# Altium schematic sheet ATmega16_RTD.SchDoc
size 594 x 420 mm
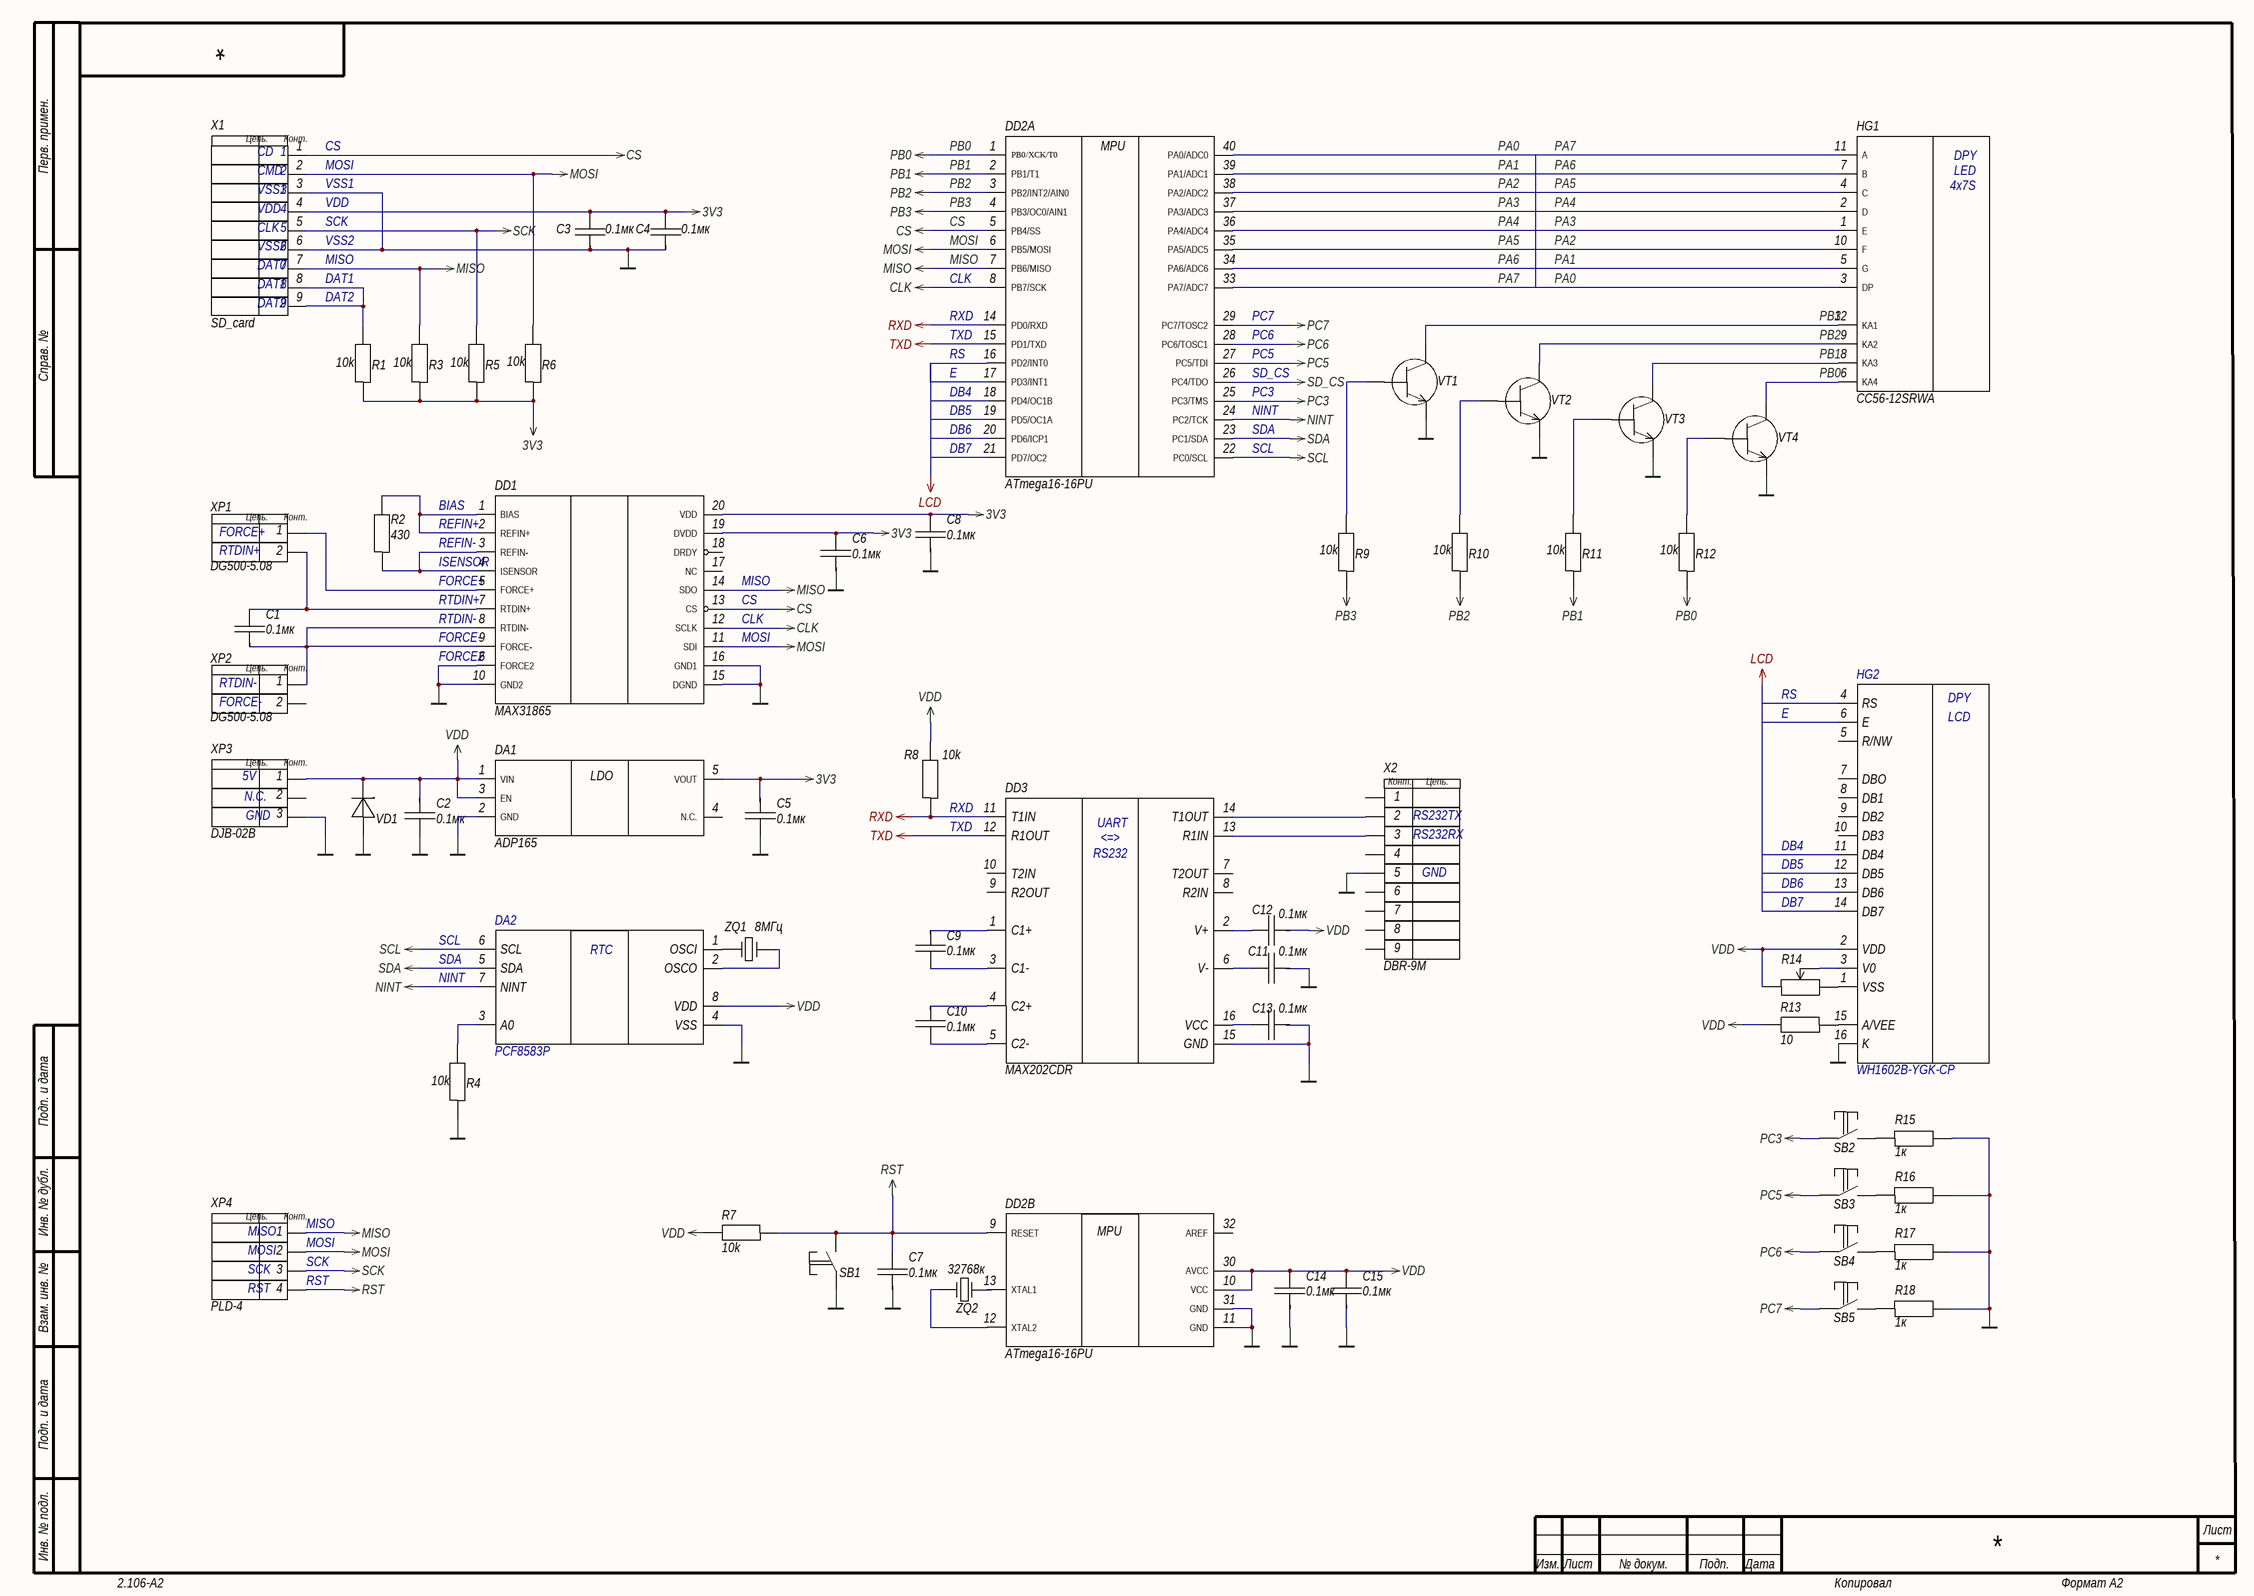
[diagram p0: ATmega16_RTD.SchDoc]

## Parts
C1  0.1мк  [Capacitor]
C2  0.1мк  [Capacitor]
C3  0.1мк  [Capacitor]
C4  0.1мк  [Capacitor]
C5  0.1мк  [Capacitor]
C6  0.1мк  [Capacitor]
C7  0.1мк  [Capacitor]
C8  0.1мк  [Capacitor]
C9  0.1мк  [Capacitor]
C10  0.1мк  [Capacitor]
C11  0.1мк  [Capacitor]
C12  0.1мк  [Capacitor]
C13  0.1мк  [Capacitor]
C14  0.1мк  [Capacitor]
C15  0.1мк  [Capacitor]
DA1  ADP165
DA2  PCF8583P
DD1  MAX31865
DD2  ATmega16-16PU  (parts A,B of 2)
DD3  MAX202CDR
HG1  CC56-12SRWA
HG2  WH1602B-YGK-CP
R1  10k  [0603_RES]
R2  430  [0603_RES]
R3  10k  [0603_RES]
R4  10k  [0603_RES]
R5  10k  [0603_RES]
R6  10k  [0603_RES]
R7  10k  [0603_RES]
R8  10k  [0603_RES]
R9  10k  [0603_RES]
R10  10k  [0603_RES]
R11  10k  [0603_RES]
R12  10k  [0603_RES]
R13  10  [0603_RES]
R14  (no value)  [0603_RES]
R15  1к  [0603_RES]
R16  1к  [0603_RES]
R17  1к  [0603_RES]
R18  1к  [0603_RES]
SB1  2-1437565-7  [TACT_Switch]  (value not drawn)
SB2  2-1437565-7  [TACT_Switch]  (value not drawn)
SB3  2-1437565-7  [TACT_Switch]  (value not drawn)
SB4  2-1437565-7  [TACT_Switch]  (value not drawn)
SB5  2-1437565-7  [TACT_Switch]  (value not drawn)
VD1  SS14-E3/61T  [SS14-E3/61T]  (value not drawn)
VT1  transistor_BC546_sevseg  (value not drawn)
VT2  transistor_BC546_sevseg  (value not drawn)
VT3  transistor_BC546_sevseg  (value not drawn)
VT4  transistor_BC546_sevseg  (value not drawn)
X1  SD_card
X2  DBR-9M
XP1  DG500-5.08
XP2  DG500-5.08
XP3  DJB-02B
XP4  PLD-4
ZQ1  8МГц  [KX-KT 16.0 MHz]
ZQ2  32768к  [KX-KT 16.0 MHz]

## Nets
3V3: C3.1 C4.1 C5.2 C6.1 C8.1 DA1.5(VOUT) DD1.19(DVDD) DD1.20(VDD) R1.1(GND) R3.1(GND) R5.1(GND) R6.1(GND) X1.4(VDD)
CLK: DD1.12(SCLK) DD2.8(PB7/SCK)
CS: DD1.13(CS) DD2.5(PB4/SS) X1.1(CD)
GND: C2.1 C3.2 C4.2 C5.1 C6.2 C7.2 C8.2 C11.2 C13.2 C14.2 C15.2 DA1.2(GND) DA2.4(VSS) DD1.6(FORCE2) DD1.10(GND2) DD1.15(DGND) DD1.16(GND1) DD2.11(GND) DD2.31(GND) DD3.15(GND) HG2.16(K) R4.1(GND) R15.2(GND) R16.2(GND) R17.2(GND) R18.2(GND) SB1.1(EP) VD1.1(GND) VT1.Y118 VT2.Y118 VT3.Y118 VT4.Y118 X1.3(VSS1) X1.6(VSS2) X2.22(GND) XP3.GND
MISO: DD1.14(SDO) DD2.7(PB6/MISO) R3.2(GND) X1.7(DAT0) XP4.Y124(5V)
MOSI: DD1.11(SDI) DD2.6(PB5/MOSI) R6.2(GND) X1.2(CMD) XP4.Y125(NC)
NINT: DA2.7(NINT) DD2.24(PC2/TCK)
PB0: DD2.1(PB0/XCK/T0) R12.1(GND)
PB1: DD2.2(PB1/T1) R11.1(GND)
PB2: DD2.3(PB2/INT2/AIN0) R10.1(GND)
PB3: DD2.4(PB3/OC0/AIN1) R9.1(GND)
PC3: DD2.25(PC3/TMS) SB2.1(EP)
PC5: DD2.27(PC5/TDI) SB3.1(EP)
PC6: DD2.28(PC6/TOSC1) SB4.1(EP)
PC7: DD2.29(PC7/TOSC2) SB5.1(EP)
RST: C7.1 DD2.9(RESET) R7.1(GND) SB1.2(EP) XP4.GND
RXD: DD2.14(PD0/RXD) DD3.11(T1IN) R8.1(GND)
SCK: R5.2(GND) X1.5(CLK) XP4.GND
SCL: DA2.6(SCL) DD2.22(PC0/SCL)
SD_CS: DD2.26(PC4/TDO)
SDA: DA2.5(SDA) DD2.23(PC1/SDA)
TXD: DD2.15(PD1/TXD) DD3.12(R1OUT)
VDD: C2.2 C12.2 C14.1 C15.1 DA1.1(VIN) DA1.3(EN) DA2.8(VDD) DD2.10(VCC) DD2.30(AVCC) HG2.2(VDD) R7.2(GND) R8.2(GND) R13.2(GND) R14.1(GND) VD1.2(GND) XP3.Y124(5V)
NetC1_1: C1.1 DD1.7(RTDIN+) XP1.5
NetC1_2: C1.2 DD1.8(RTDIN-) DD1.9(FORCE-) XP2.4
NetC9_1: C9.1 DD3.3(C1-)
NetC9_2: C9.2 DD3.1(C1+)
NetC10_1: C10.1 DD3.5(C2-)
NetC10_2: C10.2 DD3.4(C2+)
NetC11_1: C11.1 DD3.6(V-)
NetC12_1: C12.1 DD3.2(V+)
NetC13_1: C13.1 DD3.16(VCC)
NetDA2_1: DA2.1(OSCI) ZQ1.1(EP)
NetDA2_2: DA2.2(OSCO) ZQ1.2(EP)
NetDA2_3: DA2.3(A0) R4.2(GND)
NetDD1_1: DD1.1(BIAS) DD1.2(REFIN+) R2.2(GND)
NetDD1_3: DD1.3(REFIN-) DD1.4(ISENSOR) R2.1(GND)
NetDD1_5: DD1.5(FORCE+) XP1.4
NetDD2_12: DD2.12(XTAL2) ZQ2.2(EP)
NetDD2_13: DD2.13(XTAL1) ZQ2.1(EP)
NetDD2_16: DD2.16(PD2/INT0) DD2.17(PD3/INT1)
NetDD2_33: DD2.33(PA7/ADC7) HG1.3(DP)
NetDD2_34: DD2.34(PA6/ADC6) HG1.5(G)
NetDD2_35: DD2.35(PA5/ADC5) HG1.10(F)
NetDD2_36: DD2.36(PA4/ADC4) HG1.1(E)
NetDD2_37: DD2.37(PA3/ADC3) HG1.2(D)
NetDD2_38: DD2.38(PA2/ADC2) HG1.4(C)
NetDD2_39: DD2.39(PA1/ADC1) HG1.7(B)
NetDD2_40: DD2.40(PA0/ADC0) HG1.11(A)
NetDD3_13: DD3.13(R1IN) X2.20(GND)
NetDD3_14: DD3.14(T1OUT) X2.19(GND)
NetHG1_6: HG1.6(KA4) VT4.Y117
NetHG1_8: HG1.8(KA3) VT3.Y117
NetHG1_9: HG1.9(KA2) VT2.Y117
NetHG1_12: HG1.12(KA1) VT1.Y117
NetHG2_1: HG2.1(VSS) R14.2(GND)
NetHG2_3: HG2.3(V0) R14.3
NetHG2_15: HG2.15(A/VEE) R13.1(GND)
NetR1_2: R1.2(GND) X1.8(DAT1) X1.9(DAT2)
NetR9_2: R9.2(GND) VT1.Y116
NetR10_2: R10.2(GND) VT2.Y116
NetR11_2: R11.2(GND) VT3.Y116
NetR12_2: R12.2(GND) VT4.Y116
NetR15_1: R15.1(GND) SB2.2(EP)
NetR16_1: R16.1(GND) SB3.2(EP)
NetR17_1: R17.1(GND) SB4.2(EP)
NetR18_1: R18.1(GND) SB5.2(EP)

Not connected (* = marked no-connect by the designer): DA1 4(N.C.); DD1 17(NC) 18(DRDY); DD2 18(PD4/OC1B) 19(PD5/OC1A) 20(PD6/ICP1) 21(PD7/OC2) 32(AREF); DD3 7(T2OUT) 8(R2IN) 9(R2OUT) 10(T2IN); HG2 4(RS) 5(R/NW) 6(E) 7(DBO) 8(DB1) 9(DB2) 10(DB3) 11(DB4) 12(DB5) 13(DB6) 14(DB7); X2 18(GND) 21(GND) 23(GND) 24(GND) 25(GND) 26(GND); XP2 5; XP3 Y125(NC)

## Notes on the sheet
- (near X1) MOSI
- (near X1) CS
- (near DD2) PB0
- (near DD2) PB1
- PA0
- PA1
- PA7
- PA6
- (near X1) VSS1
- (near X1) VDD
- (near DD2) PB2
- (near DD2) PB3
- PA2
- PA3
- PA5
- PA4
- (near X1) MISO
- (near X1) SCK
- (near X1) VSS2
- CS
- (near DD2) MOSI
- (near DD2) MISO
- DAT1
- DAT2
- (near DD2) CLK
- (near DD2) RXD
- (near DD2) TXD
- RS
- (near DD2) PC7
- (near DD2) PC6
- (near DD2) PC5
- (near HG1) PB3
- (near HG1) PB2
- (near HG1) PB1
- E
- (near DD2) DB4
- (near DD2) PC3
- (near DD2) SD_CS
- (near HG1) PB0
- (near DD2) DB5
- (near DD2) DB6
- (near DD2) DB7
- (near DD2) NINT
- (near DD2) SCL
- (near DD2) SDA
- (near XP1) FORCE+
- (near DD1) REFIN-
- (near DD1) REFIN+
- (near DD1) BIAS
- (near XP1) RTDIN+
- (near DD1) FORCE+
- (near DD1) ISENSOR
- (near DD1) MISO
- (near DD1) FORCE-
- (near DD1) RTDIN+
- (near DD1) RTDIN-
- (near DD1) CS
- (near DD1) CLK
- (near DD1) MOSI
- RTDIN-
- (near DD1) FORCE2
- (near XP2) FORCE-
- (near R8) RXD
- TXD
- DB4
- DB5
- DB6
- DB7
- (near DA2) NINT
- (near DA2) SCL
- (near DA2) SDA
- (near XP4) MISO
- (near XP4) MOSI
- (near XP4) SCK
- (near XP4) RST
- Labels drawn without touching a wire or pin: LCD
- Перв. примен.
- Справ. №
- Подп. и дата
- Инв. № дубл.
- Взам. инв. №
- Инв. № подл.
- Изм.
- Лист
- № докум.
- Подп.
- Дата
- 2.106-A2
- Копировал
- Формат А2
- (in symbol 5V) Цепь.; Конт.; 1; N.C.; 2; 3
- (in symbol ATMEGA 16, part A) MPU
- (in symbol ATMEGA 16, part B) MPU
- (in symbol LCD) DPY
- (in symbol MAX_202) UART; <=>; RS232
- (in symbol Pt_100) Цепь.; Конт.; 1; 2
- (in symbol rtc) RTC
- (in symbol SD_card) Цепь.; Конт.
- (in symbol SevSeg_blok) DPY; LED; 4x7S
- (in symbol SPI programer) Цепь.; Конт.; MISO; 1; MOSI; 2; SCK; 3; RST; 4
- (in symbol UART(RS-232)) Конт.; Цепь.; 1; 2; RS232TX; 3; RS232RX; 4; 5; 6; 7; 8; 9

## Library data of the parts
C1-C15 = Capacitor: ValueType: Конденсатор; Value: *; Tolerance: *; Dielectric: *; Voltage: *; ESR: *; URL: *; Temp: *; Power: *; Case: *; ValueManufacturer: *; ValueManufacturerPartNumber: *; ValueDescription: *
DA1 = LDO
DA2 = rtc
DD1 = MAX 31856
DD2 = ATMEGA 16
DD3 = MAX_202
HG1 = SevSeg_blok
HG2 = LCD
R1-R13 R15-R18 = Resistor: ValueType: Резистор; Tolerance: *; URL: *; Temp: *; Power: *; Case: *; ValueManufacturer: *; ValueManufacturerParyNumber: *; ValueDescription: *
  R1-R13: Value: *
  R15-R18: Value: 1к
R14 = Resistor_PEREM: ValueType: Резистор; Value: *; Tolerance: *; URL: *; Temp: *; Power: *; Case: *; ValueManufacturer: *; ValueManufacturerParyNumber: *; ValueDescription: *
SB1-SB5 = Button: ValueManufacturer: Te Connectivity; ValueType: Кнопка тактовая; Temp: *; URL: *; Value: *; ValueDescription: *; ValueManufacturerPartNumber: 2-1437565-7
VD1 = Diode: ValueManufacturer: Vishay; ValueManufacturerPartNumber: SS14-E3/61T
X2 = UART(RS-232)
XP1 XP2 = Pt_100
XP3 = 5V
XP4 = SPI programer
ZQ1 ZQ2 = Quartz: ValueType: Кварцевый резонатор; Tolerance: *; URL: *; Case: *; ValueManufacturer: *; ValueManufacturerParetNumber: *; ValueDescription: *
  ZQ1: Value: 8МГц
  ZQ2: Value: 32768к